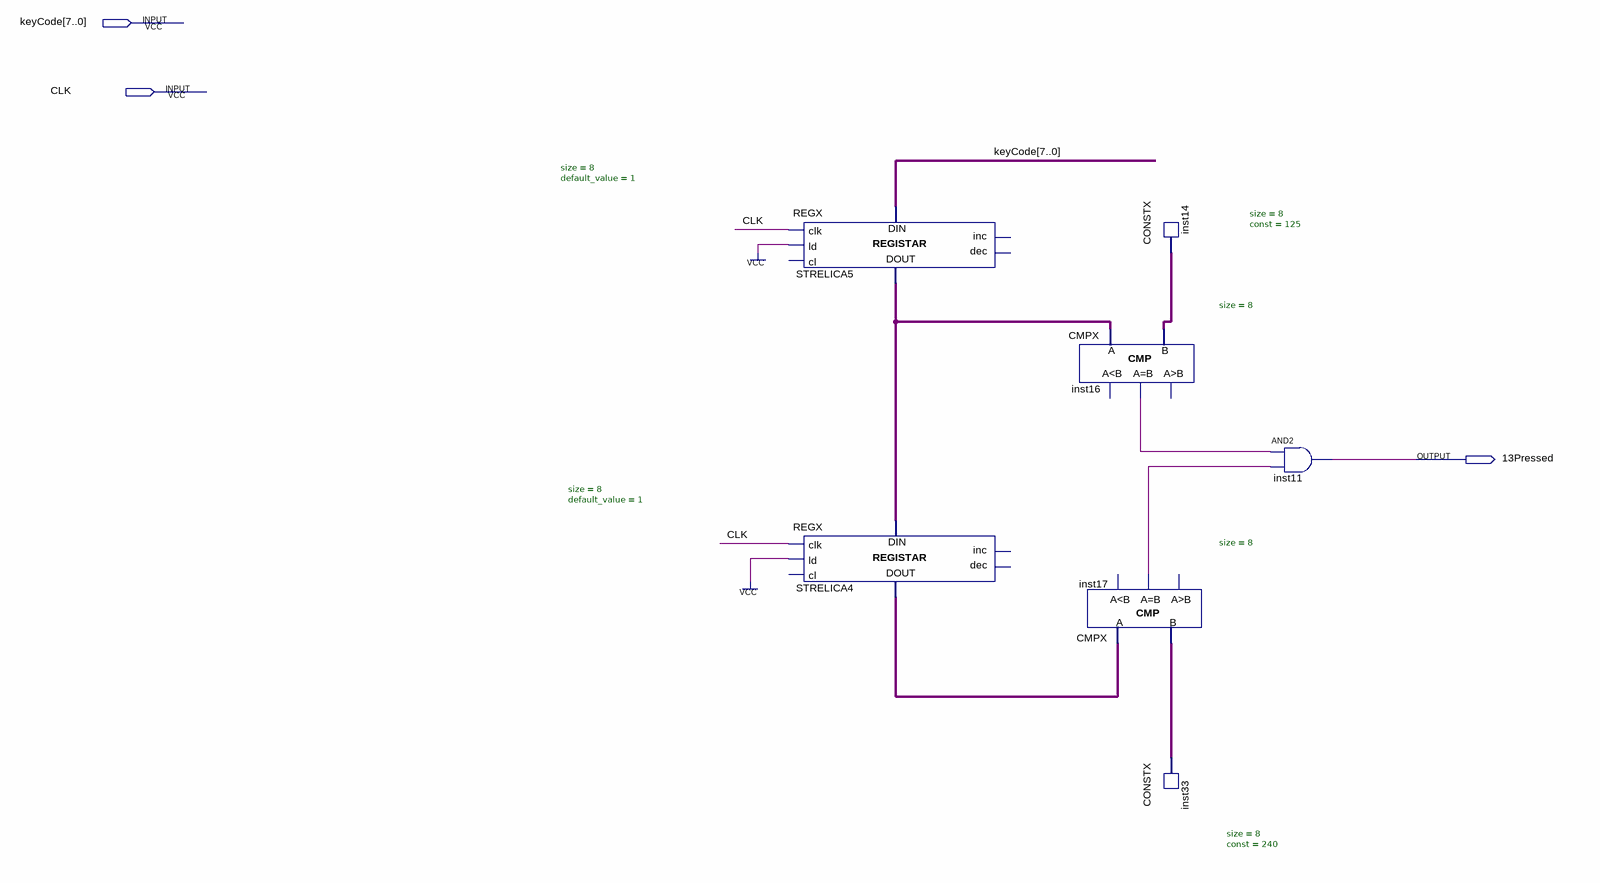
[diagram p0: schematic sheet]
// Quartus schematic Detect13.bdf as structural Verilog: 7 symbols, 3 pins
module Detect13 (
  input  [7:0] keyCode,
  input  CLK,
  output \13Pressed 
);

  wire inst16_eq, inst17_eq;
  wire [7:0] inst14_data, inst33_data, STRELICA4_data_out, STRELICA5_data_out;

  REGX #(.size(8), .default_value(1)) STRELICA5 (
    .clk(CLK), .ld(1'b1), .data_in(keyCode), .data_out(STRELICA5_data_out));  // open: cl, inc, dec
  REGX #(.size(8), .default_value(1)) STRELICA4 (
    .clk(CLK), .ld(1'b1), .data_in(STRELICA5_data_out), .data_out(STRELICA4_data_out));  // open: cl, inc, dec
  CMPX #(.size(8)) inst16 (.A(STRELICA5_data_out), .B(inst14_data), .eq(inst16_eq));  // open: ls, gr
  CMPX #(.size(8)) inst17 (.A(STRELICA4_data_out), .B(inst33_data), .eq(inst17_eq));  // open: ls, gr
  CONSTX #(.size(8), .\const (125)) inst14 (.data(inst14_data));
  CONSTX #(.size(8), .\const (240)) inst33 (.data(inst33_data));
  and inst11 (\13Pressed , inst16_eq, inst17_eq);
endmodule
